# EAGLE design Driver (EAGLE 9.6.2)
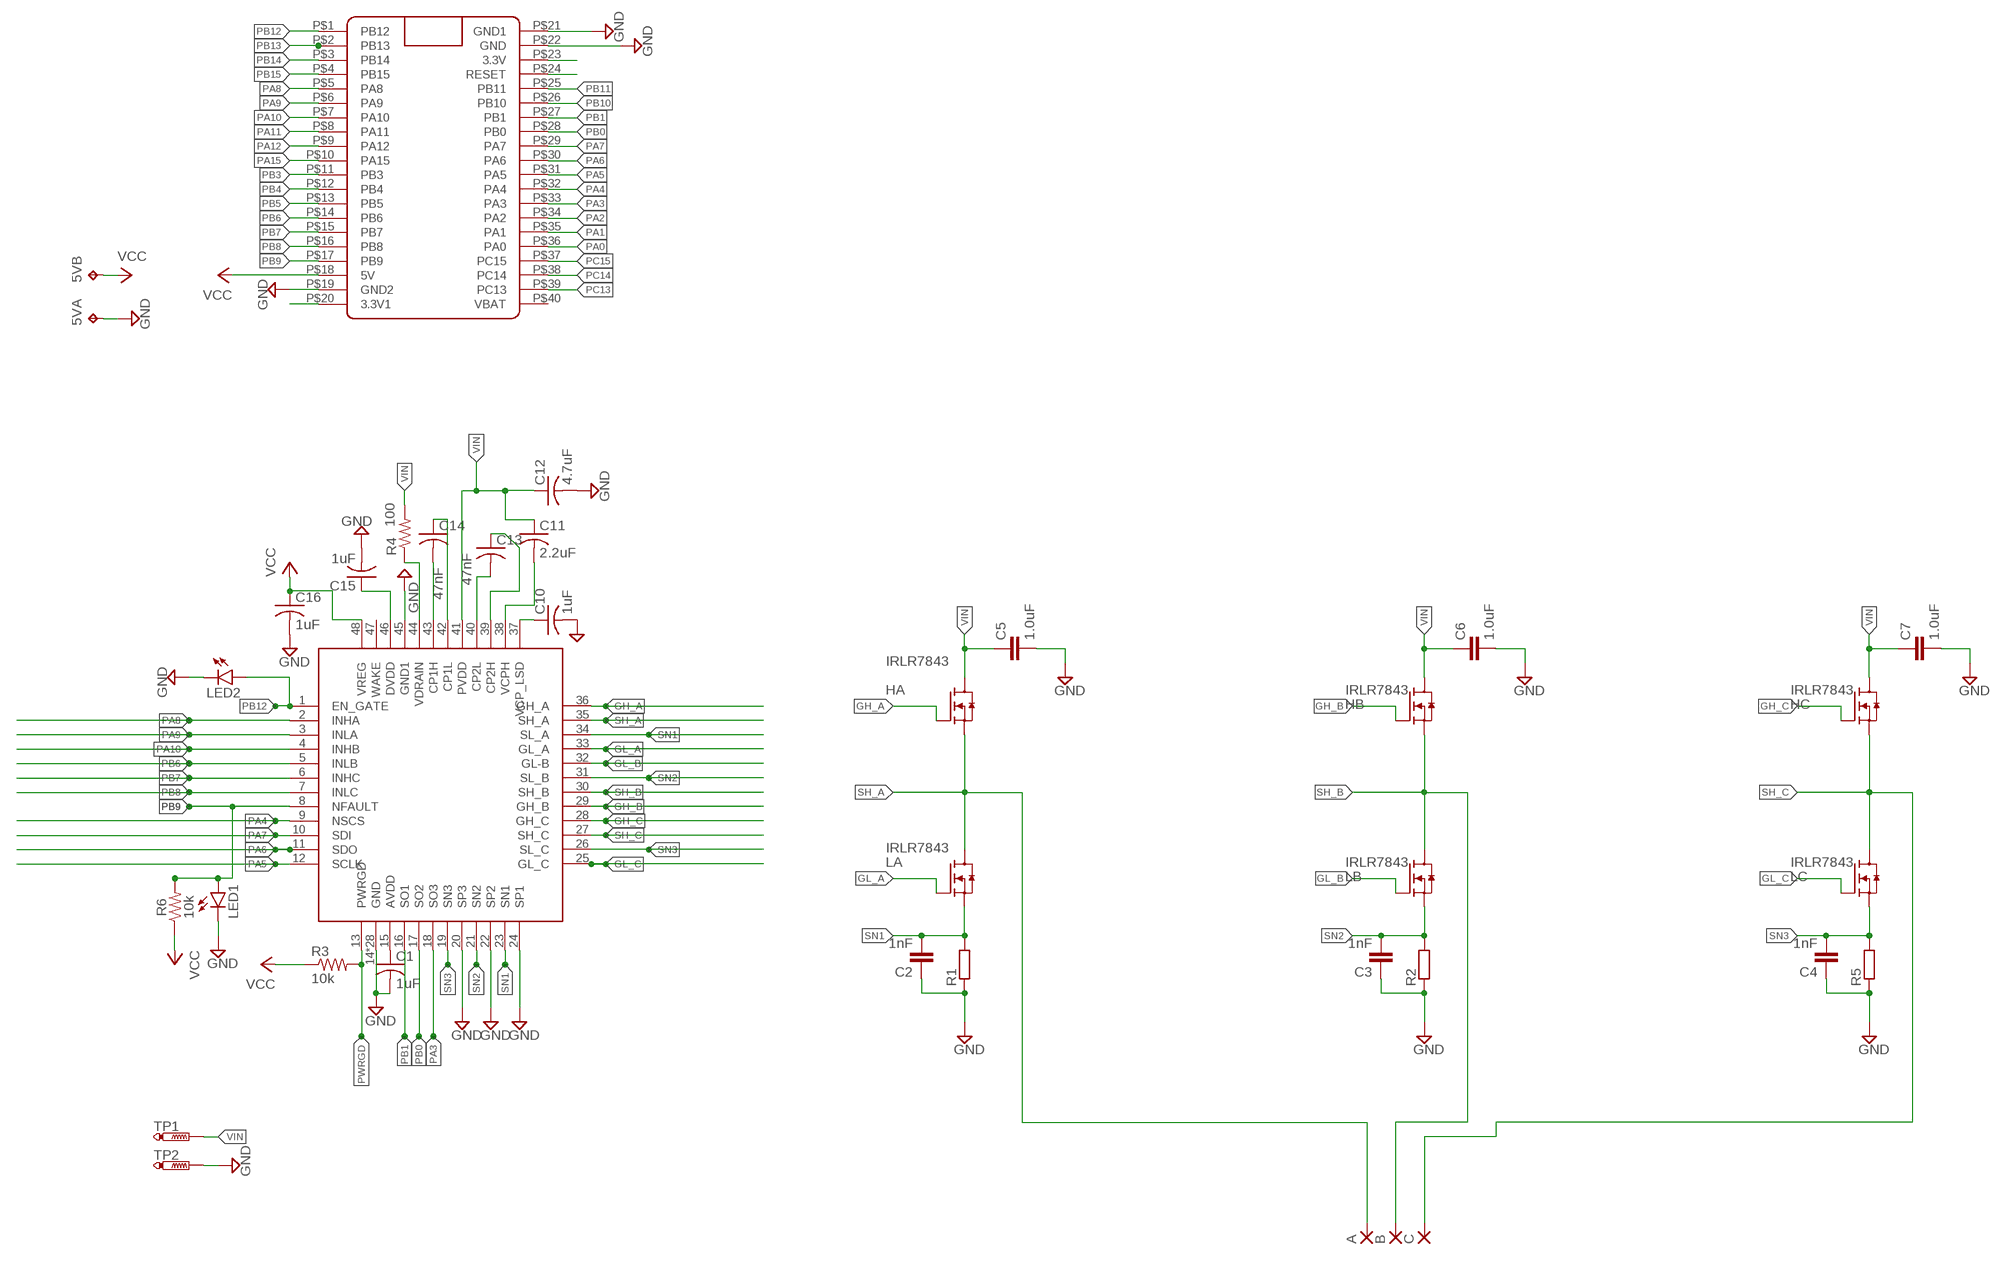
[diagram p0: schematic, sheet 1]

## Parts
5V  TP2P2-38-17  [P2-38-17]
A  SMD5  [SMD2,54-5,08]
B  SMD5  [SMD2,54-5,08]
C  SMD5  [SMD2,54-5,08]
C1  1uF  C-USC0603  [C0603]
C2  1nF  1.0NF/1000PF-0603-50V-10%  [0603]
C3  1nF  1.0NF/1000PF-0603-50V-10%  [0603]
C4  1nF  1.0NF/1000PF-0603-50V-10%  [0603]
C5  1.0uF  1.0UF-0603-16V-10%-X7R  [0603]
C6  1.0uF  1.0UF-0603-16V-10%-X7R  [0603]
C7  1.0uF  1.0UF-0603-16V-10%-X7R  [0603]
C10  1uF  C-USC0603  [C0603]
C11  2.2uF  C-USC0603  [C0603]
C12  4.7uF  C-USC0603  [C0603]
C13  47nF  C-USC0603  [C0603]
C14  47nF  C-USC0603  [C0603]
C15  1uF  C-USC0603  [C0603]
C16  1uF  C-USC0603  [C0603]
HA  IRLR7843  [TO252]
HB  IRLR7843  [TO252]
HC  IRLR7843  [TO252]
LA  IRLR7843  [TO252]
LB  IRLR7843  [TO252]
LC  IRLR7843  [TO252]
LED1  LEDCHIPLED_0805  [CHIPLED_0805]
LED2  LEDCHIPLED_0805  [CHIPLED_0805]
R1  R-EU_R2512  [R2512]
R2  R-EU_R2512  [R2512]
R3  10k  R-US_R0603  [R0603]
R4  100  R-US_R0603  [R0603]
R5  R-EU_R2512  [R2512]
R6  10k  10KOHM-0603-1/10W-1%  [0603]
TP1  PTR1PAD1-20Y  [P1-20Y]
TP2  PTR1PAD1-20Y  [P1-20Y]
U$1  BLUE_PILLADVANCED  [BLUE_PILL_ADV]
U$3  DRV8305  [PFB_S-PQFP-G48]

## Nets
CP1H: C14.2 U$3.43(CP1H)
CP1L: C14.1 U$3.42(CP1L)
CP2H: C13.1 U$3.39(CP2H)
CP2L: C13.2 U$3.40(CP2L)
DVDD: C15.1 U$3.46(DVDD)
GH_A: HA.1(G) U$3.36(GH_A)
GH_B: HB.1(G) U$3.29(GH_B)
GH_C: HC.1(G) U$3.28(GH_C)
GL_A: LA.1(G) U$3.33(GL_A)
GL_B: LB.1(G) U$3.32(GL-B)
GL_C: LC.1(G) U$3.25(GL_C)
GND: 5V.TP-1 C1.2 C2.1 C3.1 C4.1 C5.2 C6.2 C7.2 C10.2 C12.2 C15.2 C16.2 LED1.C LED2.C R1.1 R2.1 R5.1 TP2.TP U$1.P$19(GND2) U$1.P$21(GND1) U$1.P$22(GND) U$3.14(GND) U$3.20(SP3) U$3.22(SP2) U$3.24(SP1) U$3.45(GND1) U$3.P$1(GND) U$3.P$2(GND) U$3.P$3(GND) U$3.P$4(GND) U$3.P$5(GND) U$3.P$6(GND) U$3.P$7(GND) U$3.P$8(GND) U$3.P$9(GND) U$3.P$10(GND) U$3.P$11(GND) U$3.P$12(GND) U$3.P$13(GND) U$3.P$14(GND) U$3.P$15(GND) U$3.P$16(GND) U$3.P$17(GND) U$3.P$18(GND) U$3.P$19(GND) U$3.P$20(GND) U$3.P$21(GND) U$3.P$22(GND) U$3.P$23(GND) U$3.P$24(GND) U$3.P$25(GND) U$3.P$26(GND) U$3.P$27(GND)
N$3: U$1.P$23(3.3V)
N$4: U$1.P$24(RESET)
N$15: C1.1 U$3.15(AVDD)
N$40: U$1.P$20(3.3V1)
PA0: U$1.P$36(PA0)
PA1: U$1.P$35(PA1)
PA2: U$1.P$34(PA2)
PA3: U$1.P$33(PA3) U$3.18(SO3)
PA4: U$1.P$32(PA4) U$3.9(NSCS)
PA5: U$1.P$31(PA5) U$3.12(SCLK)
PA6: U$1.P$30(PA6) U$3.11(SDO)
PA7: U$1.P$29(PA7) U$3.10(SDI)
PA8: U$1.P$5(PA8) U$3.2(INHA)
PA9: U$1.P$6(PA9) U$3.3(INLA)
PA10: U$1.P$7(PA10) U$3.4(INHB)
PA11: U$1.P$8(PA11)
PA12: U$1.P$9(PA12)
PA15: U$1.P$10(PA15)
PB0: U$1.P$28(PB0) U$3.17(SO2)
PB1: U$1.P$27(PB1) U$3.16(SO1)
PB3: U$1.P$11(PB3)
PB4: U$1.P$12(PB4)
PB5: U$1.P$13(PB5)
PB6: U$1.P$14(PB6) U$3.5(INLB)
PB7: U$1.P$15(PB7) U$3.6(INHC)
PB8: U$1.P$16(PB8) U$3.7(INLC)
PB9: LED1.A R6.2 U$1.P$17(PB9) U$3.8(NFAULT)
PB10: U$1.P$26(PB10)
PB11: U$1.P$25(PB11)
PB12: LED2.A U$1.P$1(PB12) U$3.1(EN_GATE)
PB13: U$1.P$2(PB13)
PB14: U$1.P$3(PB14)
PB15: U$1.P$4(PB15)
PC13: U$1.P$39(PC13)
PC14: U$1.P$38(PC14)
PC15: U$1.P$37(PC15)
PWRGD: R3.2 U$3.13(PWRGD)
SH_A: A.1(P) HA.2(S) LA.3(D) U$3.35(SH_A)
SH_B: B.1(P) HB.2(S) LB.3(D) U$3.30(SH_B)
SH_C: C.1(P) HC.2(S) LC.3(D) U$3.27(SH_C)
SN1: C2.2 LA.2(S) R1.2 U$3.23(SN1) U$3.34(SL_A)
SN2: C3.2 LB.2(S) R2.2 U$3.21(SN2) U$3.31(SL_B)
SN3: C4.2 LC.2(S) R5.2 U$3.19(SN3) U$3.26(SL_C)
VCC: 5V.TP-2 C16.1 R3.1 R6.1 U$1.P$18(5V) U$3.48(VREG)
VCP_LSD: C10.1 U$3.37(VCP_LSD)
VCPH: C11.2 U$3.38(VCPH)
VDRAIN: R4.1 U$3.44(VDRAIN)
VIN: C5.1 C6.1 C7.1 C11.1 C12.1 HA.3(D) HB.3(D) HC.3(D) R4.2 TP1.TP U$3.41(PVDD)
Unconnected: U$1.P$40(VBAT) U$3.47(WAKE)

## Library data of the parts
5V = testpad:TP2: Test pad
A B C = wirepad:SMD5: SMD PAD
C1 C10-C16 = rcl:C-US: CAPACITOR, American symbol; SPICEPREFIX: C
C2-C4 = SparkFun-Capacitors:1.0NF/1000PF: 1nF/1,000pF ceramic capacitors A capacitor is a passive two-terminal electrical component used to store electrical energy temporarily in an electric field.; PROD_ID: CAP-07886
C5-C7 = SparkFun-Capacitors:1.0UF: 1µF ceramic capacitors A capacitor is a passive two-terminal electrical component used to store electrical energy temporarily in an electric field.; PROD_ID: CAP-13930
HA HB HC LA LB LC = BLDC project:IRLR7843
LED1 LED2 = led:LED: LED OSRAM: - CHIPLED LG R971, LG N971, LY N971, LG Q971, LY Q971, LO R971, LY R971 LH N974, LH R974 LS Q976, LO Q976, LY Q976 LO Q996 - Hyper CHIPLED LW Q18S LB Q993, LB Q99A, LB R99A - SideLED LS A670, LO A670, LY A670, LG A670, LP A670 LB A673, LV A673, LT A673, LW A673 LH A674 LY A675 LS A676, LA A676, LO A676, LY A676, LW A676 LS A679, LY A679, LG A679 - Hyper Micro SIDELED® LS Y876, LA Y876, LO Y876, LY Y876 LT Y87S - SmartLED LW L88C, LW L88S LB L89C, LB L89S, LG L890 LS L89K, LO L89K, LY L89K LS L896, LA L896, LO L896, LY L896 - TOPLED LS T670, LO T670, LY T670, LG T670, LP T670 LSG T670, LSP T670, LSY T670, LOP T670, LYG T670 LG T671, LOG T671, LSG T671 LB T673, LV T673, LT T673, LW T673 LH T674 LS T676, LA T676, LO T676, LY T676, LB T676, LH T676, LSB T676, LW T676 LB T67C, LV T67C, LT T67C, LS T67K, LO T67K, LY T67K, LW E67C LS E67B, LA E67B, LO E67B, LY E67B, LB E67C, LV E67C, LT E67C LW T67C LS T679, LY T679, LG T679 LS T770, LO T770, LY T770, LG T770, LP T770 LB T773, LV T773, LT T773, LW T773 LH T774 LS E675, LA E675, LY E675, LS T675 LS T776, LA T776, LO T776, LY T776, LB T776 LHGB T686 LT T68C, LB T68C - Hyper Mini TOPLED® LB M676 - Mini TOPLED Santana® LG M470 LS M47K, LO M47K, LY M47K Source: http://www.osram.convergy.de LUXEON: - LUMILED® LXK2-PW12-R00, LXK2-PW12-S00, LXK2-PW14-U00, LXK2-PW14-V00 LXK2-PM12-R00, LXK2-PM12-S00, LXK2-PM14-U00 LXK2-PE12-Q00, LXK2-PE12-R00, LXK2-PE12-S00, LXK2-PE14-T00, LXK2-PE14-U00 LXK2-PB12-K00, LXK2-PB12-L00, LXK2-PB12-M00, LXK2-PB14-N00, LXK2-PB14-P00, LXK2-PB14-Q00 LXK2-PR12-L00, LXK2-PR12-M00, LXK2-PR14-Q00, LXK2-PR14-R00 LXK2-PD12-Q00, LXK2-PD12-R00, LXK2-PD12-S00 LXK2-PH12-R00, LXK2-PH12-S00 LXK2-PL12-P00, LXK2-PL12-Q00, LXK2-PL12-R00 Source: www.luxeon.com KINGBRIGHT: KA-3528ASYC Source: www.kingbright.com
R1 R2 R5 = rcl:R-EU_: RESISTOR, European symbol; SPICEPREFIX: R
R3 R4 = rcl:R-US_: RESISTOR, American symbol; SPICEPREFIX: R
R6 = SparkFun-Resistors:10KOHM: 10kΩ resistor A resistor is a passive two-terminal electrical component that implements electrical resistance as a circuit element. Resistors act to reduce current flow, and, at the same time, act to lower voltage levels within circuits. - Wikipedia; PROD_ID: RES-00824
TP1 TP2 = testpad:PTR1: TEST PIN
U$1 = BluePill:BLUE_PILL
U$3 = BLDC project:DRV8305

## Board
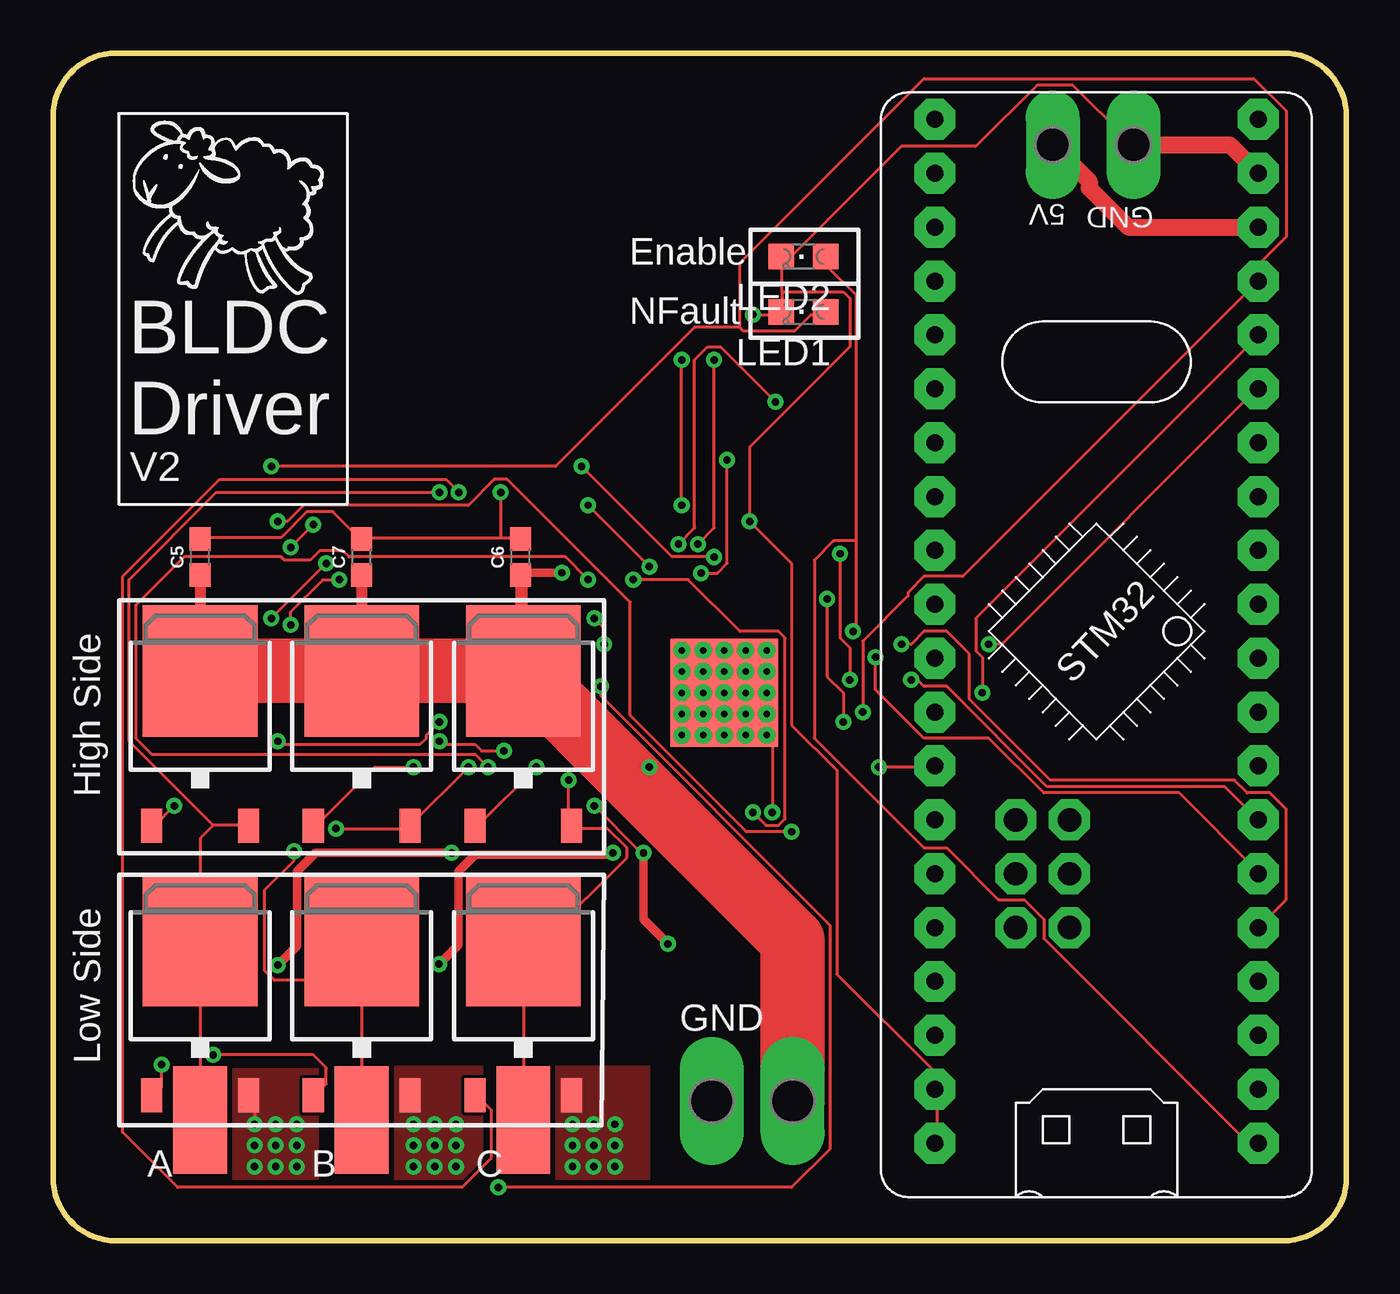
[diagram p1: board, top side]
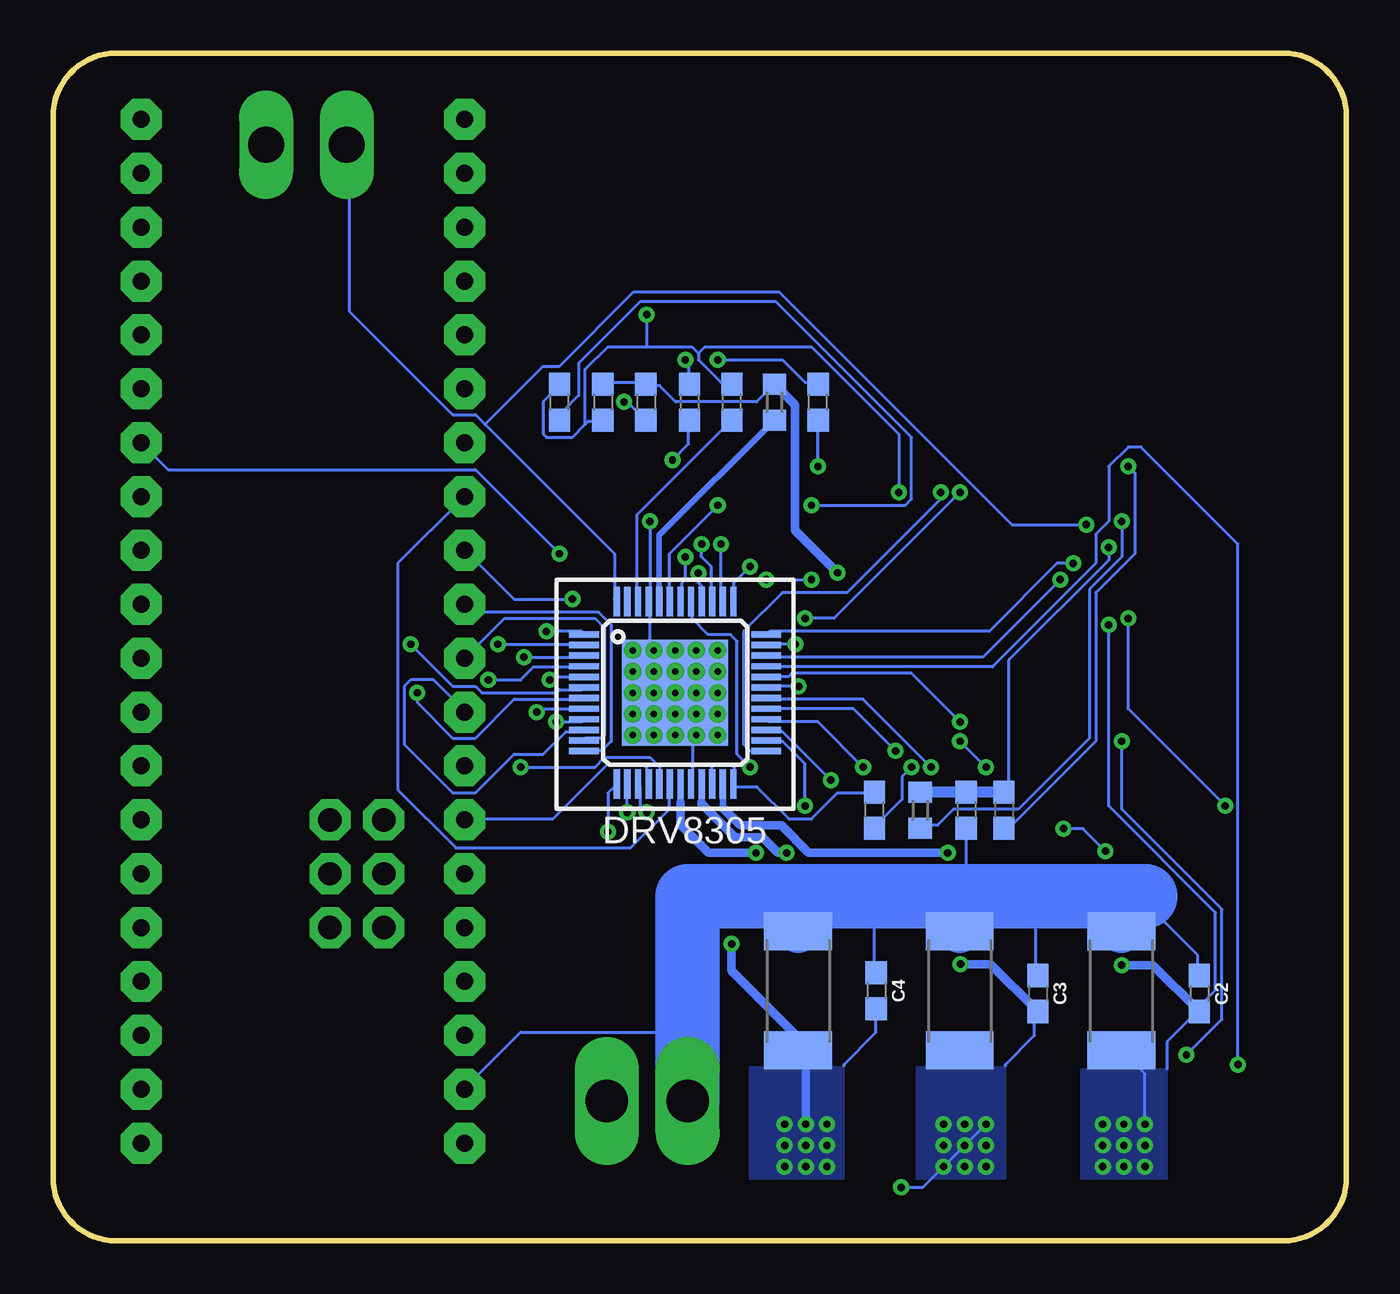
[diagram p2: board, bottom side, seen from below]

Size 61 x 56 mm. Coordinates in mm from the lower left corner, seen from the top.
Outline: 61,3 61,53 arc90 58,56 3,56 arc90 0,53 0,3 arc90 3,0 58,0 arc90 61,3
Copper layers (1*16): Top 0.035mm / dielectric 1.5mm / Bottom 0.035mm
Design rules "default *": minimum track width 6mil, minimum drill 0.35mm, track to track 6mil, track to pad 6mil, pad to pad 6mil, via to via 6mil, smd to smd 6mil, copper to edge 6mil, drill to drill 6mil, minimum pad ring 10mil, minimum via ring 8mil, stop-mask expansion 4mil, vias tented up to drill 3mm, thermal gap 0mil

### Footprints (pad centres in the part's own frame; a part is rotated, then mirrored left to right if it is on the bottom)
P2-38-17 = drill 1.702 pad 2.121 long: TP-1 -1.905,0; TP-2 1.905,0
SMD2,54-5,08 = smd 2.54 x 5.08: 1 0,0
C0603 = smd 1.1 x 1: 1 -0.85,0; 2 0.85,0
0603 = smd 1.1 x 1: 1 -0.85,0; 2 0.85,0
TO252 = smd 1 x 1.6: 1 -2.28,-4.8; 2 2.28,-4.8 | smd 5.4 x 6.2: 3 0,2.5
CHIPLED_0805 = smd 1.2 x 1.2: A 0,-1.05; C 0,1.05
R2512 = smd 1.8 x 3.2: 1 -2.8,0; 2 2.8,0
R0603 = smd 1 x 1.1: 1 -0.85,0; 2 0.85,0
P1-20Y = drill 2.007 pad 2.54 long: TP 0,0
BLUE_PILL_ADV = drill 0.8 pad 1.93 octagon: P$1 10.16,-30.48; P$2 10.16,-27.94; P$3 10.16,-25.4; P$4 10.16,-22.86; P$5 10.16,-20.32; P$6 10.16,-17.78; P$7 10.16,-15.24; P$8 10.16,-12.7; P$9 10.16,-10.16; P$10 10.16,-7.62; P$11 10.16,-5.08; P$12 10.16,-2.54; P$13 10.16,0; P$14 10.16,2.54; P$15 10.16,5.08; P$16 10.16,7.62; P$17 10.16,10.16; P$18 10.16,12.7; P$19 10.16,15.24; P$20 10.16,17.78; P$21 -5.08,-30.48; P$22 -5.08,-27.94; P$23 -5.08,-25.4; P$24 -5.08,-22.86; P$25 -5.08,-20.32; P$26 -5.08,-17.78; P$27 -5.08,-15.24; P$28 -5.08,-12.7; P$29 -5.08,-10.16; P$30 -5.08,-7.62; P$31 -5.08,-5.08; P$32 -5.08,-2.54; P$33 -5.08,0; P$34 -5.08,2.54; P$35 -5.08,5.08; P$36 -5.08,7.62; P$37 -5.08,10.16; P$38 -5.08,12.7; P$39 -5.08,15.24; P$40 -5.08,17.78 | drill 1.1 pad 1.93 octagon: P$42 -1.27,-20.32; P$43 -1.27,-17.78; P$44 -1.27,-15.24; P$45 1.27,-15.24; P$46 1.27,-17.78; P$47 1.27,-20.32
PFB_S-PQFP-G48 = smd 1.4 x 0.3: 1 -4.3,2.75; 2 -4.3,2.25; 3 -4.3,1.75; 4 -4.3,1.25; 5 -4.3,0.75; 6 -4.3,0.25; 7 -4.3,-0.25; 8 -4.3,-0.75; 9 -4.3,-1.25; 10 -4.3,-1.75; 11 -4.3,-2.25; 12 -4.3,-2.75; 25 4.3,-2.75; 26 4.3,-2.25; 27 4.3,-1.75; 28 4.3,-1.25; 29 4.3,-0.75; 30 4.3,-0.25; 31 4.3,0.25; 32 4.3,0.75; 33 4.3,1.25; 34 4.3,1.75; 35 4.3,2.25; 36 4.3,2.75 | smd 0.3 x 1.4: 13 -2.75,-4.3; 14 -2.25,-4.3; 15 -1.75,-4.3; 16 -1.25,-4.3; 17 -0.75,-4.3; 18 -0.25,-4.3; 19 0.25,-4.3; 20 0.75,-4.3; 21 1.25,-4.3; 22 1.75,-4.3; 23 2.25,-4.3; 24 2.75,-4.3; 37 2.75,4.3; 38 2.25,4.3; 39 1.75,4.3; 40 1.25,4.3; 41 0.75,4.3; 42 0.25,4.3; 43 -0.25,4.3; 44 -0.75,4.3; 45 -1.25,4.3; 46 -1.75,4.3; 47 -2.25,4.3; 48 -2.75,4.3 | smd 5 x 5: P$1 0,0 | drill 0.305: P$2 -2,2; P$3 -1,2; P$4 0,2; P$5 1,2; P$6 2,2; P$7 -2,1; P$8 -1,1; P$9 0,1; P$10 1,1; P$11 2,1; P$12 2,0; P$13 1,0; P$14 0,0; P$15 -1,0; P$16 -2,0; P$17 -2,-1; P$18 -1,-1; P$19 0,-1; P$20 1,-1; P$21 2,-1; P$22 2,-2; P$23 1,-2; P$24 0,-2; P$25 -1,-2; P$26 -2,-2 | smd 5.08 x 5.08 bottom: P$27 0,0

### Placement (x,y rotation side)
5V  49.05,51.67 180 top
A  6.94,5.7 0 top
B  14.56,5.7 0 top
C  22.18,5.7 0 top
C1  22.26,20.3 90 bottom
C2  6.94,11.67 270 bottom
C3  14.56,11.67 270 bottom
C4  22.18,11.79 270 bottom
C5  6.94,32.24 90 top
C6  22.05,32.24 90 top
C7  14.56,32.24 90 top
C10  37.11,39.54 90 bottom
C11  33.05,39.54 270 bottom
C12  35.08,39.54 270 bottom
C13  30.99,39.54 270 bottom
C14  24.92,39.54 90 bottom
C15  28.98,39.54 90 bottom
C16  17.94,20.3 270 bottom
HA  6.94,24.37 0 top
HB  14.56,24.37 0 top
HC  22.18,24.37 0 top
LA  6.94,11.67 0 top
LB  14.56,11.67 0 top
LC  22.18,11.67 0 top
LED1  35.4,43.8 90 top
LED2  35.4,46.4 90 top
R1  10.62,11.79 270 bottom
R2  18.24,11.79 270 bottom
R3  20.1,20.3 270 bottom
R4  26.98,39.54 90 bottom
R5  25.86,11.79 270 bottom
R6  16.16,20.3 270 bottom
TP1  34.88,6.59 0 top
TP2  31.07,6.59 0 top
U$1  46.67,35.09 0 top
U$3  31.66,25.84 0 bottom

### Tracks (layer width: path | path; a pad name or v marks a point on that pad's centre or on a via)
CP1H  (via drill 0.35)
  Top 0.152: v29.65,34.68 v29.65,41.54
  Bottom 0.152: v29.65,41.54 26.6,41.54 25.54,40.47 24.93,40.47 C14.2 | v29.65,34.68 31.94,32.39 31.94,30.26 U$3.43
CP1L  (via drill 0.35)
  Top 0.152: v24.93,36.51 29.19,32.24 v31.18,32.24
  Bottom 0.152: v24.93,36.51 24.93,38.64 C14.1 | v31.18,32.24 31.18,31.18 31.33,31.02 31.33,30.26 U$3.42
CP2H  (via drill 0.35)
  Top 0.152: v31.18,41.54 31.18,33.61 v30.41,32.85
  Bottom 0.152: v31.18,41.54 31.02,41.39 31.02,40.47 C13.1 | v30.41,32.85 30.41,32.24 29.96,31.79 29.96,30.26 U$3.39
CP2L  (via drill 0.35)
  Top 0.152: v31.79,36.81 31.79,31.94 31.33,31.48 v30.57,31.48
  Bottom 0.152: v31.79,36.81 31.02,37.58 31.02,38.64 C13.2 | v30.57,31.48 30.57,31.02 30.41,30.87 30.41,30.26 U$3.40
DVDD
  Bottom 0.152: C15.1 29.04,38.64 33.46,34.22 33.46,30.26 U$3.46
GH_A  (via drill 0.35)
  Top 0.152: v10.3,29.35 v12.89,31.94 | v5.72,20.51 4.81,19.59 HA.1
  Bottom 0.152: v12.89,31.94 13.65,31.94 16.85,28.74 27.21,28.74 U$3.36 | v10.3,29.35 10.3,25.08 v5.72,20.51
GH_B  (via drill 0.35)
  Top 0.152: v21.27,23.1 20.2,23.1 19.9,23.4 18.37,23.4 v18.22,23.55 | v17,22.34 15.17,22.34 12.43,19.59 HB.1
  Bottom 0.152: v21.27,23.1 23.25,25.08 27.21,25.08 U$3.29 | v17,22.34 v18.22,23.55
GH_C  (via drill 0.35)
  Top 0.152: v22.79,22.34 20.05,19.59 HC.1
  Bottom 0.152: v22.79,22.34 24.93,24.47 27.21,24.47 U$3.28
GL_A  (via drill 0.35)
  Top 0.152: v5.12,8.32 5.12,7.25 4.81,6.94 LA.1
  Bottom 0.152: v5.12,8.32 5.12,32.85 9.69,37.42 10.3,37.42 11.21,36.51 11.21,33.92 11.82,33.31 11.82,31.94 16.7,27.06 27.21,27.06 U$3.33
GL_B  (via drill 0.35)
  Top 0.152: v18.22,24.47 17.61,23.86 17.61,23.71 17.31,23.4 10.75,23.4 v10.6,23.55 | v7.55,8.77 12.28,8.77 12.89,8.16 12.89,7.4 12.43,6.94 LB.1
  Bottom 0.152: v18.22,24.47 20.51,26.76 26.15,26.76 26.3,26.6 27.21,26.6 U$3.32 | v10.6,23.55 10.6,20.36 5.88,15.63 5.88,10.45 v7.55,8.77
GL_C  (via drill 0.35)
  Top 0.152: v19.14,35.29 18.53,35.9 7.86,35.9 3.29,31.33 3.29,5.12 5.88,2.52 19.29,2.52 20.66,3.9 20.66,6.18 20.05,6.79 LC.1
  Bottom 0.152: v19.14,35.29 19.14,34.98 23.55,30.57 26.6,30.57 28.43,28.74 28.43,23.4 28.13,23.1 U$3.25
GND  (via drill 0.35)
  Top 0.152: U$3.P$6 U$3.P$27 | U$3.P$27 U$3.P$18 U$3.P$17 33.61,24.93 33.61,25.69 U$3.P$16 | U$1.P$21 41.69,4.66 41.69,7.1 U$1.P$22 41.54,7.25 41.54,8.01 36.97,12.58 36.97,22.18 34.83,24.32 34.83,31.94 v32.85,33.92 32.85,37.42 37.58,42.15 37.58,44.43 37.27,44.74 34.38,44.74 | v33.92,20.2 33.92,23.55 33.77,23.71 U$3.P$26 | U$3.P$5 30.57,27.82 30.11,27.36 U$3.P$27 | U$3.P$7 33.61,26.91 32.7,26.91 U$3.P$8 | U$3.P$4 31.79,27.82 32.55,27.82 U$3.P$27 | U$3.P$2 33.61,27.82 32.7,27.82 U$3.P$27 | U$3.P$13 30.72,25.84 31.18,26.3 U$3.P$27 | C5.2 6.94,33.16 10.75,33.16 11.97,34.38 13.19,34.38 14.41,33.16 C7.2 14.56,33.16 21.12,33.16 | 21.12,33.16 22.03,33.16 C6.2 | 5V.TP-1 50.68,51.9 48.09,54.49 46.41,54.49 43.52,51.6 40.01,51.6 34.83,46.41 34.38,46.41 LED2.C 34.38,46.26 34.38,44.74 | v21.12,35.29 21.12,33.16 | 34.38,44.74 34.38,43.82 LED1.C 34.22,43.67 v33,43.67
  Top 0.813: 5V.TP-1 55.49,51.67 U$1.P$19
  Bottom 0.152: 30.85,22.49 30.85,23.61 30.7,23.76 U$3.P$27 | 30.85,22.49 30.85,21.62 U$3.20 | U$3.P$26 33.13,24.37 | 33.13,24.37 33.59,24.82 U$3.P$17 | 33.13,24.37 32.68,23.91 U$3.P$25 | 33.13,24.37 32.07,25.43 | U$3.P$24 31.61,23.91 30.85,23.91 U$3.P$27 | 32.07,25.43 32.22,25.43 32.52,25.74 U$3.P$15 | 32.07,25.43 U$3.P$27 | 31.61,25.89 U$3.P$27 | U$3.P$20 30.7,24.82 U$3.P$27 | U$3.P$22 29.78,23.91 U$3.P$27 | U$3.P$12 29.78,25.89 30.54,25.89 U$3.P$13 | U$3.P$8 32.68,26.8 U$3.P$27 | U$3.P$9 31.76,26.8 32.07,26.8 U$3.P$27 | 29.63,27.72 29.63,26.96 U$3.P$11 | 29.63,27.72 U$3.P$6 | 29.63,27.72 U$3.P$27 | 22.31,21.3 C1.2 22.34,21.12 24.01,21.12 25.23,19.9 26.3,19.9 27.82,21.42 28.89,21.42 U$3.24 28.89,21.57 28.89,22.34 29.04,22.49 30.11,22.49 | C2.1 7.04,12.58 7.04,13.5 8.57,15.02 9.48,16.24 9.18,17.61 | 14.66,16.24 14.66,12.58 C3.1 | 22.28,16.24 22.28,12.73 C4.1 | 10.7,16.24 10.72,16.21 | 17.92,16.24 17.92,19.44 C16.2 | 31.07,9.84 38.95,9.84 41.54,7.25 U$1.P$22 | 30.11,22.49 29.96,22.34 29.96,21.57 U$3.22 | 30.85,22.49 30.11,22.49 | 30.87,22.49 30.85,22.49 | U$3.P$27 30.72,26.76 U$3.P$10 | v33.92,20.2 33.92,21.42 U$3.14 | U$3.P$27 32.7,27.98 32.85,28.13 32.85,30.11 U$3.45 32.85,30.26 v32.85,33.92 | U$3.P$23 30.72,23.86 U$3.P$27 | U$3.P$21 29.8,24.77 30.26,24.32 U$3.P$27 | U$3.P$19 31.63,24.93 31.33,24.93 U$3.P$27 | U$3.P$3 32.7,27.82 U$3.P$27 | 35.9,38.49 36.51,37.88 37.73,37.88 37.88,38.03 37.88,39.56 37.12,40.32 C10.2 | 35.9,38.49 35.75,38.64 35.14,38.64 C12.2 | 30.57,41.84 30.57,41.54 29.5,40.47 29.04,40.47 C15.2 | 30.57,41.84 30.87,42.15 33,42.15 | 33,42.15 34.83,42.15 35.9,41.08 35.9,38.49 | v33,43.67 33,42.15
  Bottom 0.152: v21.12,35.29 21.12,38.03 25.23,42.15 30.26,42.15 30.57,41.84
  Bottom 2.032: R1.1 10.62,16.11 10.72,16.21 10.75,16.24 | R2.1 18.24,16.11 18.37,16.24 | R5.1 25.86,16.11 25.99,16.24
  Bottom 3.048: TP2.TP 31.07,9.84 31.07,16.24 25.99,16.24 22.28,16.24 18.37,16.24 17.92,16.24 14.66,16.24 10.7,16.24 9.48,16.24
N$15  (via drill 0.35)
  Top 0.152: v20.51,22.34 19.9,22.95 4.66,22.95 3.9,23.71 3.9,29.96 6.18,32.24 10.75,32.24 10.91,32.09 12.12,32.09 12.58,32.55 13.65,32.55 13.95,32.24 24.16,32.24 v25.23,31.18 | v27.36,31.18 29.96,31.18 32.39,28.74 34.22,28.74 34.53,28.43 34.53,19.9 34.22,19.59 33.61,19.59 v33,20.2
  Bottom 0.152: v20.51,22.34 20.96,21.88 20.96,20.81 22.18,19.59 C1.1 | v27.36,31.18 v25.23,31.18 | v33,20.2 33.31,20.51 33.31,21.42 U$3.15
PA3
  Bottom 0.152: U$3.18 31.94,21.42 31.94,20.36 33.77,18.53 42,18.53 44.74,21.27 44.74,31.94 41.69,34.98 U$1.P$33
PA4  (via drill 0.35)
  Top 0.152: v37.27,24.47 37.27,25.84 36.51,26.6 v36.51,30.26
  Bottom 0.152: v37.27,24.47 36.05,24.47 U$3.9 | v36.51,30.26 39.25,30.26 41.54,32.55 U$1.P$32
PA5
  Bottom 0.152: U$3.12 35.9,23.1 35.14,23.1 34.68,23.55 34.68,29.04 35.29,29.65 41.23,29.65 41.54,29.96 U$1.P$31
PA6
  Bottom 0.152: U$3.11 35.9,23.71 35.14,23.71 34.98,23.86 34.98,28.89 35.44,29.35 39.71,29.35 41.54,27.52 U$1.P$30
PA7
  Bottom 0.152: U$3.10 36.05,24.01 36.81,24.01 37.88,22.95 39.25,22.95 41.08,21.12 42.15,21.12 44.43,23.4 44.43,26.15 44.13,26.45 43.06,26.45 41.69,25.08 U$1.P$29
PA8  (via drill 0.35)
  Top 0.152: v40.01,28.13 40.47,28.13 41.08,28.74 42.15,28.74 43.22,27.67 43.22,25.54 47.02,21.73 55.71,21.73 56.32,21.12 57.39,21.12 58.15,20.36 58.15,16.09 56.93,14.87 U$1.P$5
  Bottom 0.152: v40.01,28.13 36.05,28.13 U$3.2
PA9  (via drill 0.35)
  Top 0.152: v38.8,27.52 38.8,25.99 41.08,23.71 44.13,23.71 46.72,21.12 53.12,21.12 56.78,17.46 U$1.P$6
  Bottom 0.152: v38.8,27.52 36.05,27.52 U$3.3
PA10  (via drill 0.35)
  Top 0.152: v40.47,26.45 40.78,26.45 41.08,26.15 42.15,26.15 46.87,21.42 55.25,21.42 56.78,19.9 U$1.P$7
  Bottom 0.152: v40.47,26.45 38.95,26.45 38.34,27.06 36.05,27.06 U$3.4
PB0  (via drill 0.35)
  Top 0.152: v38.95,22.34 41.54,22.34 U$1.P$28
  Bottom 0.152: v38.95,22.34 35.44,22.34 34.98,22.79 32.85,22.79 32.39,22.34 32.39,21.57 U$3.17
PB1
  Bottom 0.152: U$3.16 33,21.57 33,22.34 33.16,22.49 34.83,22.49 37.42,19.9 41.54,19.9 U$1.P$27
PB6  (via drill 0.35)
  Top 0.152: v37.58,26.45 37.58,27.98 37.12,28.43 v37.12,32.39
  Bottom 0.152: v37.58,26.45 37.42,26.6 36.05,26.6 U$3.5 | v37.12,32.39 41.08,36.36 55.56,36.36 56.78,37.58 U$1.P$14
PB7  (via drill 0.35)
  Top 0.152: v44.13,28.13 44.74,28.13 56.78,40.17 U$1.P$15
  Bottom 0.152: v44.13,28.13 42.15,26.15 41.08,26.15 40.78,25.84 37.27,25.84 37.12,25.99 36.05,25.99 U$3.6
PB8  (via drill 0.35)
  Top 0.152: v43.82,25.84 43.82,27.52 43.52,27.82 43.52,29.35 56.78,42.6 U$1.P$16
  Bottom 0.152: v43.82,25.84 43.82,25.38 42.15,23.71 41.08,23.71 39.25,25.54 36.05,25.54 U$3.7
PB9  (via drill 0.35)
  Top 0.152: v38.19,24.93 38.19,28.28 40.32,30.41 40.32,30.57 41.08,31.33 42.91,31.33 56.78,45.2 U$1.P$17 56.93,45.35 56.93,46.11 58.15,47.33 58.15,53.27 56.63,54.8 41.08,54.8 32.39,46.11 32.39,43.06 | v10.3,36.51 23.71,36.51 30.26,43.06 32.39,43.06 | 32.39,43.06 32.55,42.91 34.98,42.91 35.75,43.67 36.36,43.67 LED1.A
  Bottom 0.152: v38.19,24.93 38.03,25.08 36.05,25.08 U$3.8 | v10.3,36.51 9.99,36.2 9.99,32.39 11.82,30.57 11.82,23.55 15.78,19.59 16.09,19.59 R6.2
PB12  (via drill 0.35)
  Top 0.152: 37.88,33 37.88,28.89 v37.73,28.74 | 37.88,33 37.88,44.59 36.51,45.96 36.51,46.26 LED2.A | 37.88,33 36.81,33 35.9,32.09 35.9,23.71 41.08,18.53 42.15,18.53 44.59,16.09 45.81,16.09 46.72,15.17 46.72,14.26 56.32,4.66 56.78,4.66 U$1.P$1
  Bottom 0.152: v37.73,28.74 36.05,28.74 U$3.1
PWRGD  (via drill 0.35)
  Top 0.152: v10.6,33.92 11.06,33.92 11.82,34.68 19.59,34.68 20.81,35.9 21.42,35.9 27.21,30.11 27.21,24.77 32.7,19.29 v34.83,19.29
  Bottom 0.152: v10.6,33.92 10.6,32.24 12.12,30.72 12.12,23.71 15.48,20.36 18.53,20.36 19.29,19.59 20.05,19.59 R3.2 | v34.83,19.29 34.83,21.12 34.53,21.42 U$3.13
SH_A  (via drill 0.35)
  Top 0.152: A.1 6.94,5.72 6.94,14.11 LA.3 6.94,14.26 6.94,18.98 7.55,19.59 | v25.99,28.13 25.99,28.89 v25.54,29.35 | v18.22,35.29 7.71,35.29 3.59,31.18 3.59,23.55 7.55,19.59 | 7.55,19.59 9.08,19.59 HA.2
  Bottom 0.152: v25.99,28.13 27.21,28.13 U$3.35 | v25.54,29.35 24.16,29.35 v18.22,35.29
SH_B  (via drill 0.35)
  Top 0.152: v19.59,22.34 16.85,19.59 HB.2 16.7,19.44 v13.34,19.44 | 14.56,12.28 14.56,14.11 LB.3 14.56,12.28 | 14.56,12.28 14.56,5.72 B.1 | v11.36,18.37 11.36,17.92 9.99,16.55 9.99,12.73 10.45,12.28 14.56,12.28
  Bottom 0.152: v19.59,22.34 22.79,25.54 27.21,25.54 U$3.30 | v13.34,19.44 12.43,19.44 v11.36,18.37
SH_C  (via drill 0.35)
  Top 0.152: v24.32,21.73 24.32,19.59 HC.2 24.47,19.44 26.15,19.44 27.06,18.53 27.06,18.07 23.25,14.26 22.18,14.26 LC.3 22.18,14.11 22.18,5.72 C.1
  Bottom 0.152: v24.32,21.73 26.6,24.01 27.21,24.01 U$3.27
SN1  (via drill 0.35)
  Top 0.152: LA.2 9.5,6.59 v9.5,5.5 | v13.5,31.18 12.73,31.18 11.21,29.65 v11.21,29.04
  Top 0.406: v10.6,13 11.5,13.9 11.5,17.41 12.38,18.3 v18.8,18.3
  Bottom 0.152: v9.5,5.5 9.5,7.87 R1.2 | v13.5,31.18 17.15,27.52 27.21,27.52 U$3.34 | v11.21,29.04 11.21,20.51 6.18,15.48 6.18,11.82 6.94,11.06 C2.2 7.1,10.75 8.47,9.38 8.47,8.16 8.46,8.11
  Bottom 0.3: U$3.23 29.4,20.4
  Bottom 0.406: C2.2 9.12,13 v10.6,13 | 29.4,20.4 28.59,19.59 26.66,19.59 25.36,18.3 v18.8,18.3
  other vias: 10.5,5.5 11.5,5.5 9.5,4.5 10.5,4.5 11.5,4.5 9.5,3.5 10.5,3.5 11.5,3.5
  pour Bottom: 8.46,8.11 8.46,2.91 12.53,2.91 12.53,8.11
  pour Top: 8.46,8.11 8.46,2.91 12.53,2.91 12.53,8.11
SN2  (via drill 0.35)
  Top 0.152: v25.84,26.15 25.84,25.69 36.66,14.87 36.66,4.35 34.83,2.52 v21,2.52
  Top 0.406: v18.2,13.05 19.12,13.97 19.12,17.41 19.91,18.2 26.3,18.2 v26.4,18.3
  Bottom 0.152: v25.84,26.15 27.21,26.15 U$3.31 | C3.2 14.72,10.75 14.72,9.69 16.09,8.32 16.09,8.24 | v21,2.52 19.98,2.52 v17,5.5
  Bottom 0.3: 30.41,20.61 U$3.21
  Bottom 0.406: C3.2 16.79,13.05 v18.2,13.05 | 30.41,20.69 30.41,20.61 28.83,19.03 27.54,19.03 26.81,18.3 v26.4,18.3
  other vias: 18,5.5 19,5.5 17,4.5 18,4.5 19,4.5 17,3.5 18,3.5 19,3.5
  pour Top: 16.08,8.24 16.08,2.91 20.27,2.91 20.27,8.24
  pour Bottom: 16.08,8.24 16.08,2.91 20.27,2.91 20.27,8.24
SN3  (via drill 0.35)
  Top 0.152: v25.54,20.51 27.67,18.37 v27.85,18.3
  Top 0.406: v29,14 27.85,15.15 v27.85,18.3
  Bottom 0.152: C4.2 22.18,10.75 22.18,9.84 23.71,8.32 23.71,8.24 | v25.54,20.51 25.54,22.49 26.6,23.55 27.21,23.55 U$3.26
  Bottom 0.3: 31.41,20.69 U$3.19
  Bottom 0.406: C4.2 22.19,10.94 | v29,14 29,12.73 25.5,9.23 v25.5,5.5 | 31.41,20.69 31.41,19.61 30.09,18.3 v27.85,18.3
  other vias: 24.5,5.5 26.5,5.5 24.5,4.5 25.5,4.5 26.5,4.5 24.5,3.5 25.5,3.5 26.5,3.5
  pour Top: 23.7,8.24 23.7,2.91 28.15,2.91 28.15,8.24
  pour Bottom: 23.7,8.24 23.7,2.91 28.15,2.91 28.15,8.24
VCC  (via drill 0.35)
  Top 0.152: v12.28,33.77 v11.21,32.7
  Top 0.813: 5V.TP-2 48.87,49.95 48.87,49.64 50.71,47.79 U$1.P$18
  Bottom 0.152: 34.47,30.14 34.35,30.16 U$3.48 34.53,30.26 34.53,32.39 40.62,38.49 | 40.62,38.49 41.08,38.95 42.15,38.95 47.02,43.82 47.02,51.6 5V.TP-2 | v11.21,32.7 11.21,32.09 15.94,27.36 15.94,21.27 R6.1 | v12.28,33.77 15.78,33.77 26.76,44.74 33.61,44.74 37.12,41.23 37.88,41.23 40.62,38.49
  Bottom 0.508: R3.1 C16.1 R6.1 16.16,21.08
VCP_LSD  (via drill 0.35)
  Top 0.152: v28.13,31.79 v25.23,34.68
  Bottom 0.152: v25.23,34.68 20.81,34.68 20.51,34.98 20.51,37.88 26.91,44.28 33.31,44.28 36.2,41.39 36.2,39.86 36.97,39.1 36.97,38.8 C10.1 | v28.13,31.79 28.89,31.02 28.89,30.26 U$3.37
VCPH  (via drill 0.35)
  Top 0.152: v34.07,39.56 31.48,42.15 30.87,42.15 30.26,41.54 30.26,33.61 v29.5,32.85
  Bottom 0.152: v34.07,39.56 33.92,39.56 33.16,38.8 C11.2 | v29.5,32.85 29.5,30.26 U$3.38
VDRAIN
  Bottom 0.254: R4.1 32.41,33.26 U$3.44
VIN  (via drill 0.35)
  Top 0.152: v28.13,22.34 27.42,21.63
  Top 0.406: v24,31.5 22.01,31.5 22.18,31.67 HC.3
  Top 0.508: C5.1 HA.3 | C7.1 HB.3 | C6.1 22.05,27 HC.3
  Top 3.048: TP1.TP 34.88,14.17 27.42,21.63 HC.3 HB.3 HA.3
  Bottom 0.152: C12.1 34.98,40.47 33.16,40.47 C11.1 33,40.32 32.39,40.32 31.63,39.56 27.82,39.56 27.06,40.32 R4.2 | v28.13,22.34 28.74,22.95 28.74,28.28 29.04,28.58 30.11,28.58 30.87,29.35 30.87,30.11 U$3.41
  Bottom 0.406: v24,31.5 26,33.5 26,39.41 R4.2

### Text on the board
tPlace: 5V | GND
tNames: Enable | NFault | BLDC / Driver | V2 | High Side | GND | Low Side
bNames: DRV8305